# Altium schematic sheet 04_ETHERNET.SchDoc
size A4; SheetNumber: 4
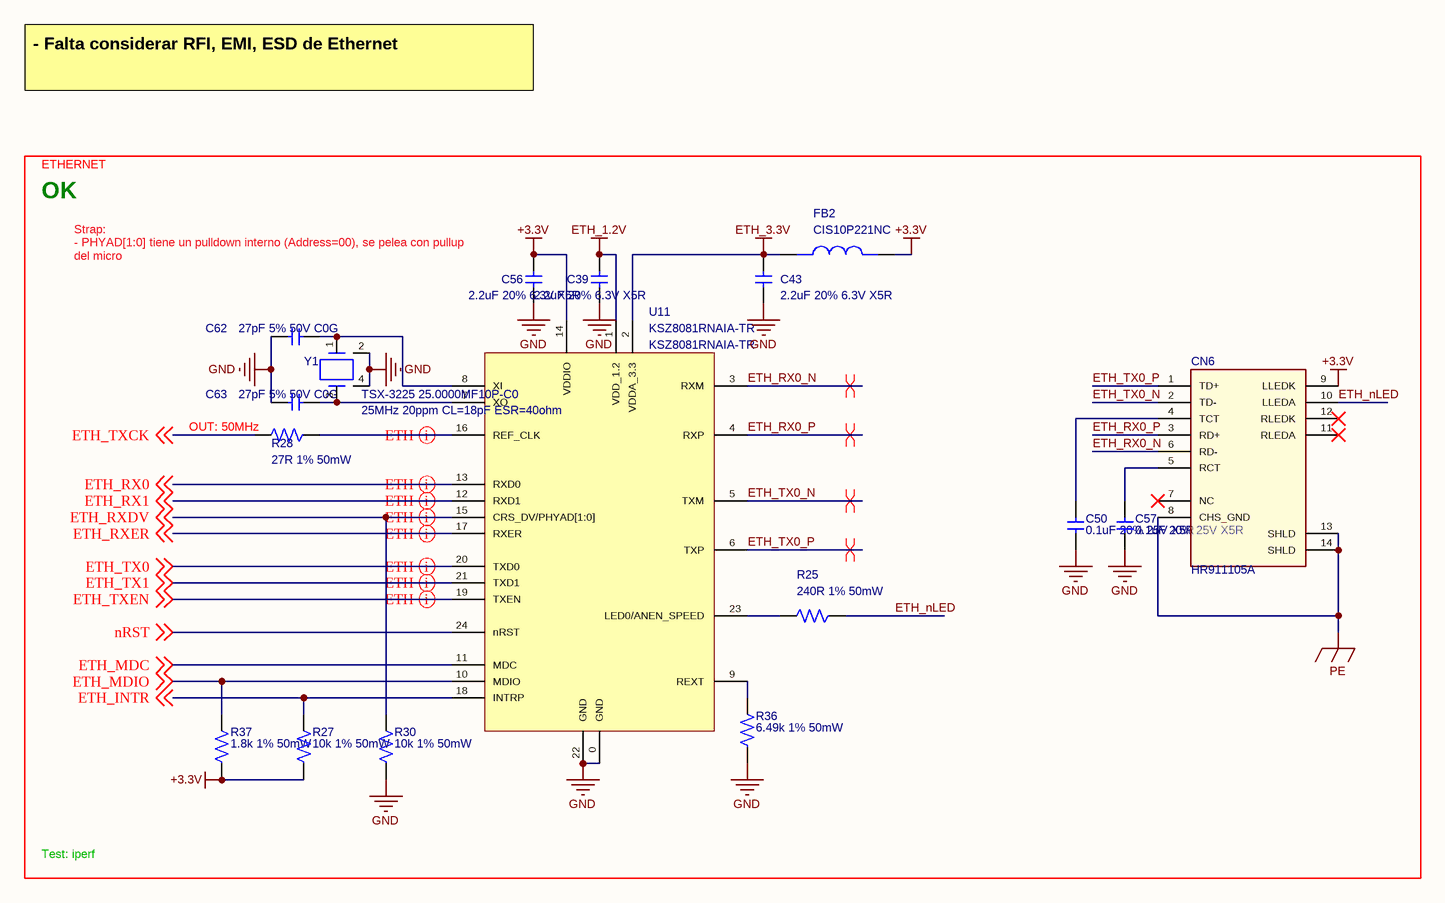
[diagram p0: 04_ETHERNET.SchDoc]

## Parts
C39  2.2uF 20% 6.3V X5R  [CAPC1608X90N]
C43  2.2uF 20% 6.3V X5R  [CAPC1608X90N]
C50  0.1uF 20% 25V X5R  [CAPC1005N]
C56  2.2uF 20% 6.3V X5R  [CAPC1608X90N]
C57  0.1uF 20% 25V X5R  [CAPC1005N]
C62  27pF 5% 50V C0G  [CAPC1005N]
C63  27pF 5% 50V C0G  [CAPC1005N]
CN6  HR911105A  [HR911105A]
FB2  CIS10P221NC  [INDC1608X95N]
R25  240R 1% 50mW  [RESC1005X40N]
R27  10k 1% 50mW  [RESC1005X40N]
R28  27R 1% 50mW  [RESC1005X40N]
R30  10k 1% 50mW  [RESC1005X40N]
R36  6.49k 1% 50mW  [RESC1005X40N]
R37  1.8k 1% 50mW  [RESC1005X40N]
U11  KSZ8081RNAIA-TR  [QFN50P400X400X80-25N]
Y1  TSX-3225 25.0000MF10P-C0  value 25MHz 20ppm CL=18pF ESR=40ohm  [XTAL3.2x2.5]

## Nets
+3.3V: C56.2 CN6.9(LLEDK) FB2.1 R27.1 R37.1 U11.14(VDDIO)
ETH_1.2V: C39.2 U11.1(VDD_1.2)
ETH_3.3V: C43.2 FB2.2 U11.2(VDDA_3.3)
GND: C39.1 C43.1 C50.1 C56.1 C57.1 C62.1 C63.1 R30.1 R36.1 U11.0(GND) U11.22(GND) Y1.2(GND) Y1.4(GND)
PE: CN6.8(CHS_GND) CN6.13(SHLD) CN6.14(SHLD)
ETH_INTR: R27.2 U11.18(INTRP) ; off-sheet ETH_INTR
ETH_MDC: U11.11(MDC) ; off-sheet ETH_MDC
ETH_MDIO: R37.2 U11.10(MDIO) ; off-sheet ETH_MDIO
ETH_nLED: CN6.10(LLEDA) R25.1
ETH_RX0: U11.13(RXD0) ; off-sheet ETH_RX0
ETH_RX0_N: CN6.6(RD-) U11.3(RXM)
ETH_RX0_P: CN6.3(RD+) U11.4(RXP)
ETH_RX1: U11.12(RXD1) ; off-sheet ETH_RX1
ETH_RXDV: R30.2 U11.15(CRS_DV/PHYAD[1:0]) ; off-sheet ETH_RXDV
ETH_RXER: U11.17(RXER) ; off-sheet ETH_RXER
ETH_TX0: U11.20(TXD0) ; off-sheet ETH_TX0
ETH_TX0_N: CN6.2(TD-) U11.5(TXM)
ETH_TX0_P: CN6.1(TD+) U11.6(TXP)
ETH_TX1: U11.21(TXD1) ; off-sheet ETH_TX1
ETH_TXCK: R28.2 ; off-sheet ETH_TXCK
ETH_TXEN: U11.19(TXEN) ; off-sheet ETH_TXEN
nRST: U11.24(nRST) ; off-sheet nRST
NetC50_2: C50.2 CN6.4(TCT)
NetC57_2: C57.2 CN6.5(RCT)
NetC62_2: C62.2 U11.8(XI) Y1.1(S1)
NetC63_2: C63.2 U11.7(XO) Y1.3(S2)
NetR25_2: R25.2 U11.23(LED0/ANEN_SPEED)
NetR28_1: R28.1 U11.16(REF_CLK)
NetR36_2: R36.2 U11.9(REXT)

Not connected (* = marked no-connect by the designer): CN6 7(NC)* 11(RLEDA)* 12(RLEDK)*

## Layout directives
differential pair: ETH_RX0_N, ETH_RX0_P, ETH_TX0_N, ETH_TX0_P
net class BUS_ETH: ETH_RX0, ETH_RX1, ETH_RXDV, ETH_RXER, ETH_TX0, ETH_TX1, ETH_TXEN, NetR28_1

## Notes on the sheet
- - Falta considerar RFI, EMI, ESD de Ethernet
- ETHERNET
- OK
- Strap:
  - PHYAD[1:0] tiene un pulldown interno (Address=00), se pelea con pullup del micro
  - ANEN_SPEED tiene un pullup interno (AutoNegotiation activo)
- (near R28) OUT: 50MHz
- Test: iperf

## Library data of the parts
C39 C43 C56 = C_Dup1: Capacitor, Ceramic; FP_DESC: C0603; MFG_PN: CL10A225KQ8NNNC; MFG: SAMSUNG; Symbol Checked: Ok; Replacement Allowed: Ask; Footprint Checked: Assign OK, Footprint OK; TECHNOLOGY: X5R; TOLERANCE: 20%; VALUE: 2.2uF; VOLTAGE: 6.3V
C50 C57 = C_Dup1: Capacitor, Ceramic; FP_DESC: C0402; MFG_PN: CL05A104KA5NNNC; MFG: SAMSUNG; Symbol Checked: Ok; Replacement Allowed: Ask; Footprint Checked: Assign OK, Footprint OK; TECHNOLOGY: X5R; TOLERANCE: 20%; VALUE: 0.1uF; VOLTAGE: 25V
C62 C63 = C_Dup1: Capacitor, Ceramic; FP_DESC: C0402; MFG_PN: <GENERIC>; Symbol Checked: Ok; Replacement Allowed: Yes; MFG: <GENERIC>; Footprint Checked: Assign OK, Footprint OK; TECHNOLOGY: C0G; TOLERANCE: 5%; VALUE: 27pF; VOLTAGE: 50V
CN6 = HR911105A: Single Port RJ45 connecto with Magnetics Module and LEDs; FP_DESC: RJ45 w/magnetics, 90°; MFG: HANRUN; Symbol Checked: Ok; Replacement Allowed: Ask; MFG_PN: HR911105A; Footprint Checked: Assign OK, Footprint OK
FB2 = Filtre ferrites CMS-742792093: Ferrite Bead; FP_DESC: L0603; MFG: SAMSUNG; Symbol Checked: Ok; Replacement Allowed: No; MFG_PN: CIS10P221NC; Footprint Checked: Assign OK, Footprint OK
R25 R27 R28 R30 R36 = R_Dup1: Resistor, SMD; MFG_PN: <GENERIC>; FP_DESC: R0402; Symbol Checked: Ok; Replacement Allowed: Yes; MFG: <GENERIC>; Footprint Checked: Assign OK, Footprint OK; POWER: 50mW; TOLERANCE: 1%
  R25: VALUE: 240R
  R27 R30: VALUE: 10k
  R28: VALUE: 27R
  R36: VALUE: 6.49k
R37 = R: Resistor, SMD; FP_DESC: R0402; MFG_PN: <GENERIC>; Symbol Checked: Ok; Replacement Allowed: Yes; MFG: <GENERIC>; Footprint Checked: Assign OK, Footprint OK; POWER: 50mW; TOLERANCE: 1%; VALUE: 1.8k
U11 = KSZ8081: 10Base-T/100Base-TX PHY with RMII Support; FP_DESC: QFN24+TAB; MFG: MICROCHIP; Symbol Checked: Ok; Replacement Allowed: No; MFG_PN: KSZ8081RNAIA-TR; Footprint Checked: Assign OK, Footprint OK
Y1 = CS10-12MHz: Crystal; MFG: EPSON; FP_DESC: XTAL 3.2x2.5; Symbol Checked: Ok; Replacement Allowed: Ask; MFG_PN: TSX-3225 25.0000MF10P-C0; Footprint Checked: Assign OK, Footprint OK